# Altium schematic sheet UART.SchDoc
size A
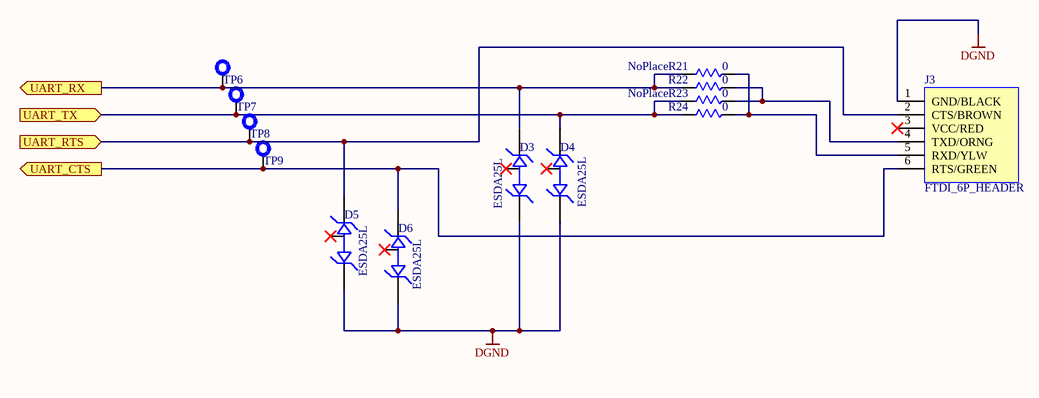
[diagram p0: UART.SchDoc]

## Parts
D3  ESDA25L  [SOT23_3_HD]
D4  ESDA25L  [SOT23_3_HD]
D5  ESDA25L  [SOT23_3_HD]
D6  ESDA25L  [SOT23_3_HD]
J3  FTDI_6P_HEADER  [GEC36SBSN-M89]
R21  value 0  NoPlace?: NoPlace  [RES_0603]  (hidden comment: RES_GEN)
R22  value 0  [RES_0603]  (hidden comment: RES_GEN)
R23  value 0  NoPlace?: NoPlace  [RES_0603]  (hidden comment: RES_GEN)
R24  value 0  [RES_0603]  (hidden comment: RES_GEN)
TP6  TEST_PT_40MIL  [TP_40MIL]  (value not drawn)
TP7  TEST_PT_40MIL  [TP_40MIL]  (value not drawn)
TP8  TEST_PT_40MIL  [TP_40MIL]  (value not drawn)
TP9  TEST_PT_40MIL  [TP_40MIL]  (value not drawn)

## Ports
UART_CTS (out), UART_RTS (in), UART_RX (out), UART_TX (in)

## Nets
DGND: D3.1 D4.1 D5.1 D6.1 J3.1(GND/BLACK)
UART_CTS: D6.2 J3.6(RTS/GREEN) TP9.1 ; port UART_CTS
UART_RTS: D5.2 J3.2(CTS/BROWN) TP8.1 ; port UART_RTS
UART_RX: D3.2 R21.1 R22.1 TP6.1 ; port UART_RX
UART_TX: D4.2 R23.1 R24.1 TP7.1 ; port UART_TX
NetJ3_4: J3.4(TXD/ORNG) R22.2 R23.2
NetJ3_5: J3.5(RXD/YLW) R21.2 R24.2

Not connected (* = marked no-connect by the designer): D3 3(NC)*; D4 3(NC)*; D5 3(NC)*; D6 3(NC)*; J3 3(VCC/RED)*

## Library data of the parts
D3-D6 = ESDA25L: TRANSIL ARRAY DUAL ESD SOT-23; Manufacturer: STMicroelectronics; Manufacturer Part Number: ESDA25L
J3 = FTDI_6P_HEADER: 6 PIN FTDI HEADER; Manufacturer: Sullins Connector Solutions; Manufacturer Part Number: GEC36SBSN-M89
R21-R24 = RES_GEN: RES 0.0 OHM 0.1W JUMPER 0603 SMD; Manufacturer: Bourns Inc; Manufacturer Part Number: CR0603-J/-000ELF
TP6-TP9 = TEST_PT_40MIL: 40MIL DIAM TEST POINT